# Altium schematic sheet Motor.SchDoc
size A
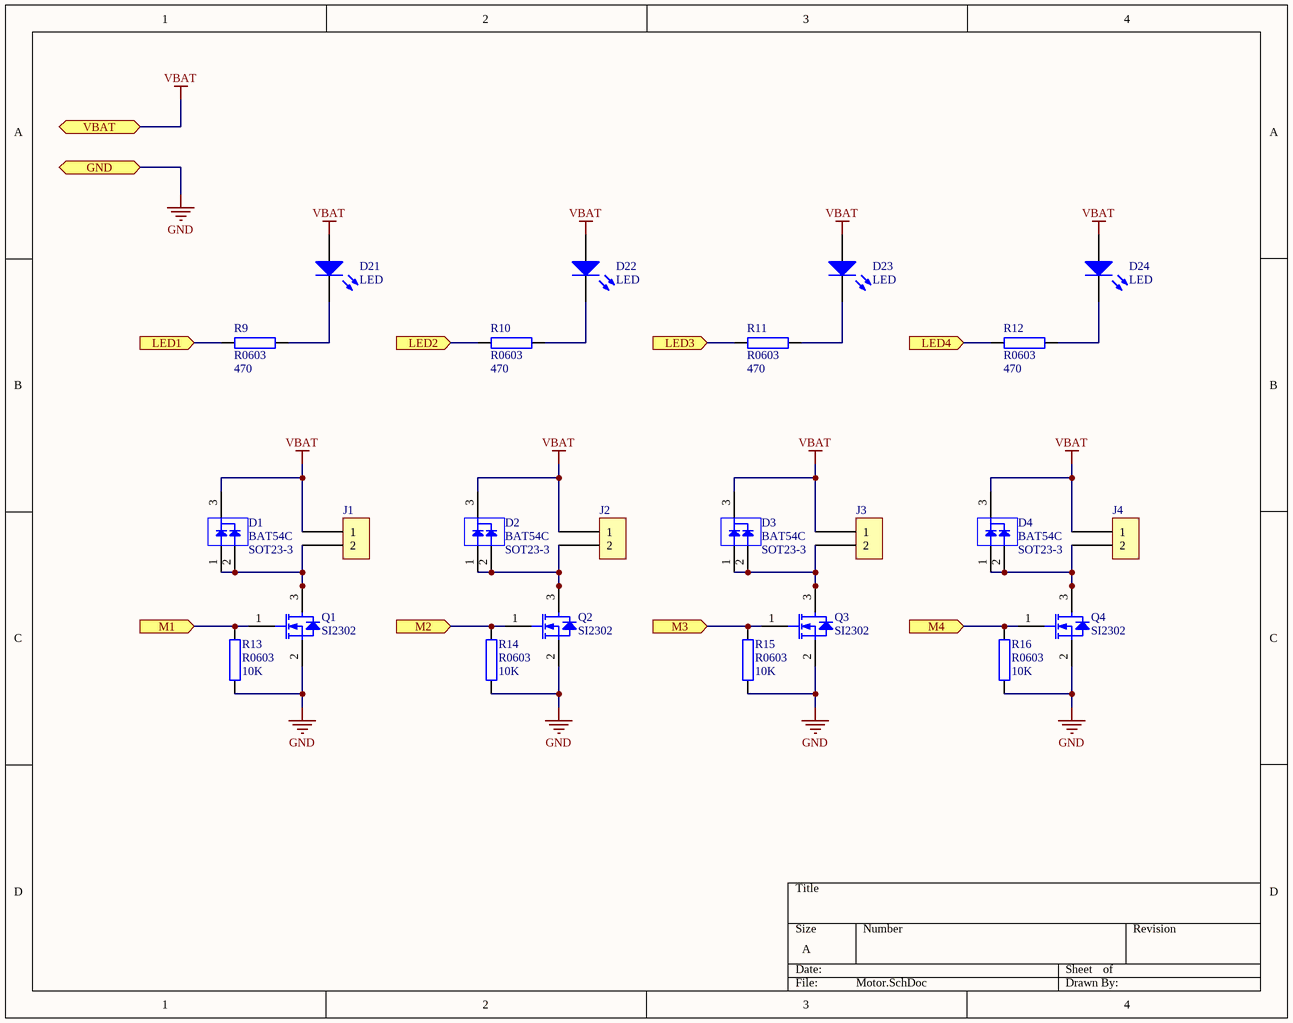
[diagram p0: Motor.SchDoc]

## Parts
D1  BAT54C  [SOT23-3]
D2  BAT54C  [SOT23-3]
D3  BAT54C  [SOT23-3]
D4  BAT54C  [SOT23-3]
D21  LED  [LED_0603]
D22  LED  [LED_0603]
D23  LED  [LED_0603]
D24  LED  [LED_0603]
J1  motor bonding pad  [Motor_Pin_Pad]  (value not drawn)
J2  motor bonding pad  [Motor_Pin_Pad]  (value not drawn)
J3  motor bonding pad  [Motor_Pin_Pad]  (value not drawn)
J4  motor bonding pad  [Motor_Pin_Pad]  (value not drawn)
Q1  SI2302  [SOT23-3]
Q2  SI2302  [SOT23-3]
Q3  SI2302  [SOT23-3]
Q4  SI2302  [SOT23-3]
R9  R0603  value 470  [R0603]
R10  R0603  value 470  [R0603]
R11  R0603  value 470  [R0603]
R12  R0603  value 470  [R0603]
R13  R0603  value 10K  [R0603]
R14  R0603  value 10K  [R0603]
R15  R0603  value 10K  [R0603]
R16  R0603  value 10K  [R0603]

## Ports
GND, LED1 (in), LED2 (in), LED3 (in), LED4 (in), M1 (in), M2 (in), M3 (in), M4 (in), VBAT

## Nets
GND: Q1.2(S) Q2.2(S) Q3.2(S) Q4.2(S) R13.1 R14.1 R15.1 R16.1 ; port GND
VBAT: D1.3 D2.3 D3.3 D4.3 D21.1(A) D22.1(A) D23.1(A) D24.1(A) J1.1 J2.1 J3.1 J4.1 ; port VBAT
LED1: R9.1 ; port LED1
LED2: R10.1 ; port LED2
LED3: R11.1 ; port LED3
LED4: R12.1 ; port LED4
M1: Q1.1(G) R13.2 ; port M1
M2: Q2.1(G) R14.2 ; port M2
M3: Q3.1(G) R15.2 ; port M3
M4: Q4.1(G) R16.2 ; port M4
NetD1_1: D1.1 D1.2 J1.2 Q1.3(D)
NetD2_1: D2.1 D2.2 J2.2 Q2.3(D)
NetD3_1: D3.1 D3.2 J3.2 Q3.3(D)
NetD4_1: D4.1 D4.2 J4.2 Q4.3(D)
NetD21_2: D21.2(K) R9.2
NetD22_2: D22.2(K) R10.2
NetD23_2: D23.2(K) R11.2
NetD24_2: D24.2(K) R12.2

## Library data of the parts
D21-D24 = LED: Typical INFRARED GaAs LED; Published: 8-Jun-2000; LatestRevisionDate: 08-Jul-2005; LatestRevisionNote: Mech Layer 1 removed.; PackageReference: LED-0; Publisher: Altium Limited; PackageDescription: LED; 2 Leads
J1-J4 = Joint_Motor
Q1-Q4 = SI2302: N-Channel MOSFET; Published: 8-Jun-2000; LatestRevisionDate: 17-Jul-2002; LatestRevisionNote: Re-released for DXP Platform.; PackageVersion: 1995/1996; PackageReference: SOT23-3; Publisher: Altium Limited; PackageDescription: TO, Flat Index; 3 In-Line, Axial Leads; Body Dia. 4.6mm; Lead Dia. 0.5 mm (max)
R9-R16 = Res3: Resistor; Published: 8-Jun-2000; LatestRevisionDate: 29-May-2009; LatestRevisionNote: IPC-7351 Footprint Added.; PackageReference: R0603; Publisher: Altium Limited; PackageDescription: Chip Resistor